# Altium schematic sheet 2.4寸LCD-CL24CR492-37B.SchDoc
size A4
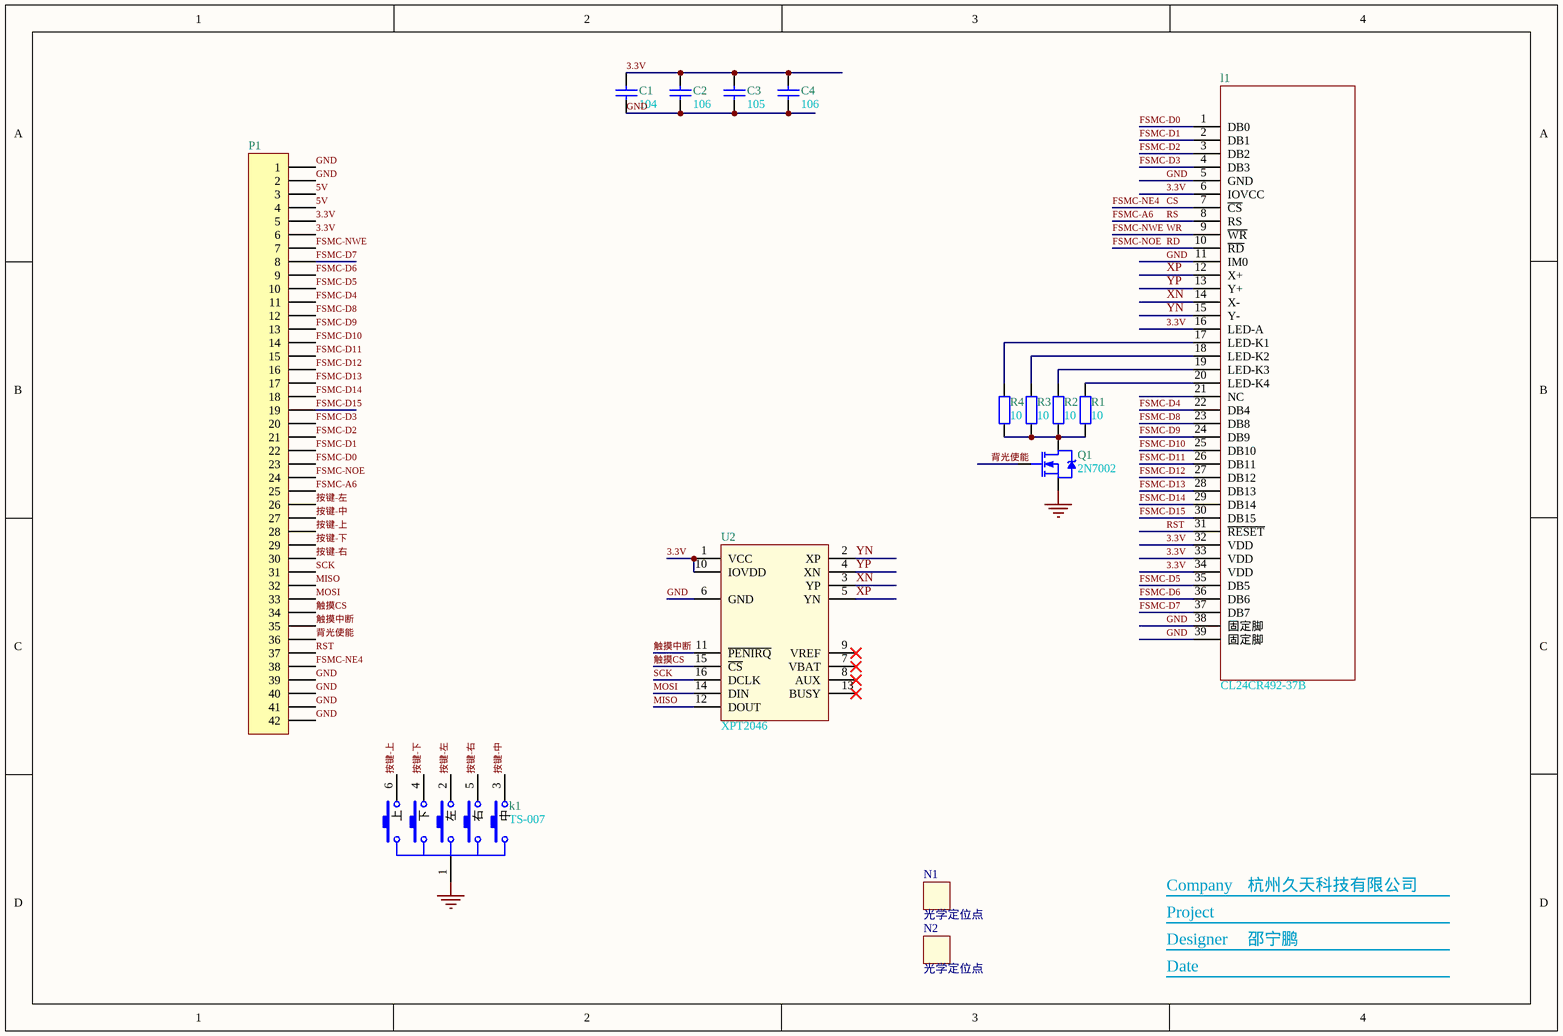
[diagram p0: 2.4寸LCD-CL24CR492-37B.SchDoc]

## Parts
C1  104  [C-0603]
C2  106  [C-0603]
C3  105  [C-0603]
C4  106  [C-0603]
k1  TS-007  [TS-007]
l1  CL24CR492-37B  [CL24CR492-37B]
N1  光学定位点  [MARK-1mm-3mm]
N2  光学定位点  [MARK-1mm-3mm]
P1  (no value)  [FPC-0.5mm_40P下接翻盖]
Q1  2N7002  [SOT-23]
R1  10  [R-0603]
R2  10  [R-0603]
R3  10  [R-0603]
R4  10  [R-0603]
U2  XPT2046  [TSSOP-16]

## Nets
GND: C1.1 C2.1 C3.1 C4.1 k1.1(Common) l1.5(GND) l1.11(IM0) l1.38(固定脚) l1.39(固定脚) P1.1 P1.2 P1.39 P1.40 P1.41 P1.42 Q1.2(S) U2.6(GND)
3.3V: C1.2 C2.2 C3.2 C4.2 l1.6(IOVCC) l1.16(LED-A) l1.32(VDD) l1.33(VDD) l1.34(VDD) P1.5 P1.6 U2.1(VCC) U2.10(IOVDD)
5V: P1.3 P1.4
CS: l1.7(~{CS}) P1.38  [also labelled FSMC-NE4]
FSMC-A6: l1.8(RS) P1.25  [also labelled RS]
FSMC-D0: l1.1(DB0) P1.23
FSMC-D1: l1.2(DB1) P1.22
FSMC-D2: l1.3(DB2) P1.21
FSMC-D3: l1.4(DB3) P1.20
FSMC-D4: l1.22(DB4) P1.11
FSMC-D5: l1.35(DB5) P1.10
FSMC-D6: l1.36(DB6) P1.9
FSMC-D7: l1.37(DB7) P1.8
FSMC-D8: l1.23(DB8) P1.12
FSMC-D9: l1.24(DB9) P1.13
FSMC-D10: l1.25(DB10) P1.14
FSMC-D11: l1.26(DB11) P1.15
FSMC-D12: l1.27(DB12) P1.16
FSMC-D13: l1.28(DB13) P1.17
FSMC-D14: l1.29(DB14) P1.18
FSMC-D15: l1.30(DB15) P1.19
FSMC-NOE: l1.10(~{RD}) P1.24  [also labelled RD]
FSMC-NWE: l1.9(~{WR}) P1.7  [also labelled WR]
MISO: P1.32 U2.12(DOUT)
MOSI: P1.33 U2.14(DIN)
RST: l1.31(~{RESET}) P1.37
SCK: P1.31 U2.16(DCLK)
XN: l1.14(X-) U2.3(YP)
XP: l1.12(X+) U2.5(YN)
YN: l1.15(Y-) U2.2(XP)
YP: l1.13(Y+) U2.4(XN)
按键-上: k1.6(上) P1.28
按键-下: k1.4(下) P1.29
按键-中: k1.3(中) P1.27
按键-右: k1.5(右) P1.30
按键-左: k1.2(左) P1.26
背光使能: P1.36 Q1.1(G)
触摸CS: P1.34 U2.15(~{CS})
触摸中断: P1.35 U2.11(~{PENIRQ})
Netl1_17: l1.17(LED-K1) R4.2
Netl1_18: l1.18(LED-K2) R3.2
Netl1_19: l1.19(LED-K3) R2.2
Netl1_20: l1.20(LED-K4) R1.2
NetQ1_3: Q1.3(D) R1.1 R2.1 R3.1 R4.1

Not connected (* = marked no-connect by the designer): l1 21(NC); U2 7(VBAT)* 8(AUX)* 9(VREF)* 13(BUSY)*

## Notes on the sheet
- Project
- Company
- 杭州久天科技有限公司
- Designer
- Date
- 邵宁鹏

## Library data of the parts
C1-C4 = Cap-0603: 0805; Published: 8-Jun-2000; LatestRevisionDate: 17-Jul-2002; LatestRevisionNote: Re-released for DXP Platform.; PackageReference: RAD-0.3; Publisher: Altium Limited
k1 = TS-007: 五向开关
N1 N2 = 无引脚
P1 = MHDR1X42
R1-R4 = Res2-0603: 0603; Published: 8-Jun-2000; LatestRevisionDate: 17-Jul-2002; LatestRevisionNote: Re-released for DXP Platform.; PackageReference: AXIAL-0.4; Publisher: Altium Limited